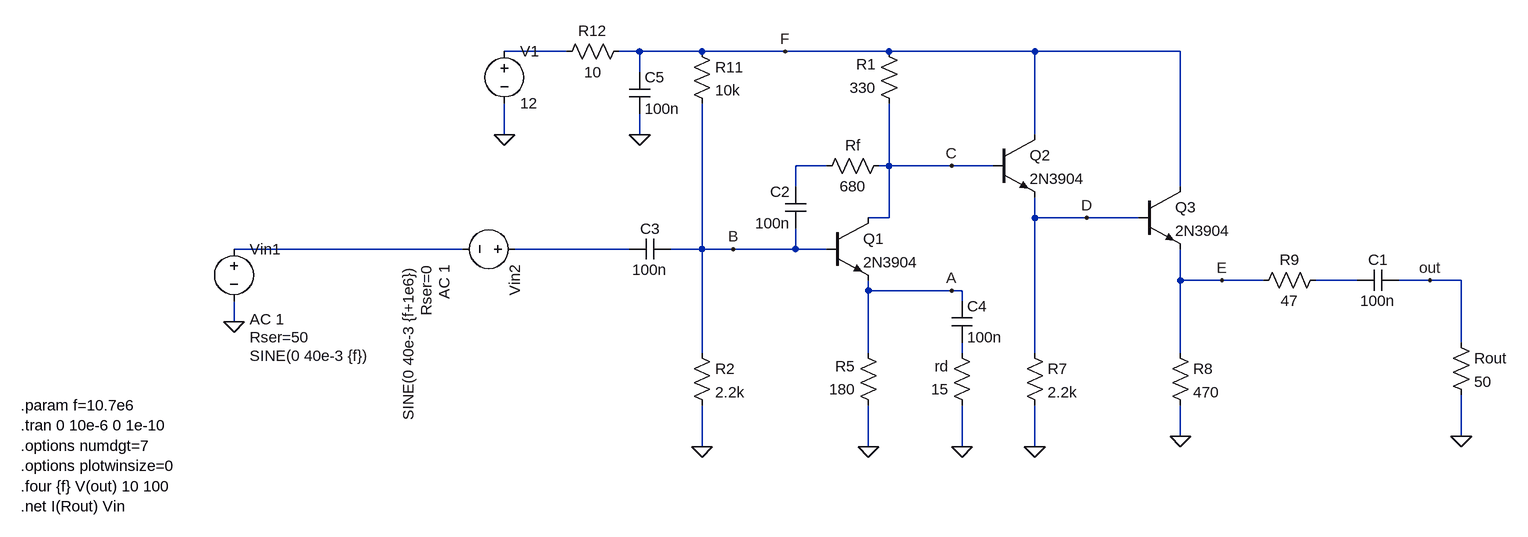
[diagram p0: schematic TIA3_12V_orig.asc]
TIA3_12V_orig.asc, the LTspice schematic file:
Version 4
SHEET 1 1168 680
WIRE -288 -128 -384 -128
WIRE -176 -128 -208 -128
WIRE -80 -128 -176 -128
WIRE 48 -128 -80 -128
WIRE 208 -128 48 -128
WIRE 432 -128 208 -128
WIRE 656 -128 432 -128
WIRE -176 -96 -176 -128
WIRE -384 0 -384 -48
WIRE -176 0 -176 -32
WIRE 432 0 432 -128
WIRE 112 48 64 48
WIRE 208 48 208 -48
WIRE 208 48 192 48
WIRE 304 48 208 48
WIRE 368 48 304 48
WIRE 64 80 64 48
WIRE 656 80 656 -128
WIRE 208 128 208 48
WIRE 208 128 176 128
WIRE 432 128 432 96
WIRE 512 128 432 128
WIRE 592 128 512 128
WIRE -448 176 -800 176
WIRE -192 176 -368 176
WIRE -80 176 -80 -48
WIRE -80 176 -128 176
WIRE -32 176 -80 176
WIRE 64 176 64 144
WIRE 64 176 -32 176
WIRE 112 176 64 176
WIRE 656 224 656 176
WIRE 720 224 656 224
WIRE 784 224 720 224
WIRE 928 224 864 224
WIRE 1040 224 992 224
WIRE 1088 224 1040 224
WIRE 176 240 176 224
WIRE 304 240 176 240
WIRE 320 240 304 240
WIRE 320 256 320 240
WIRE -800 288 -800 256
WIRE 1088 320 1088 224
WIRE -80 336 -80 176
WIRE 176 336 176 240
WIRE 320 336 320 320
WIRE 432 336 432 128
WIRE 656 336 656 224
WIRE 656 464 656 416
WIRE 1088 464 1088 400
WIRE -80 480 -80 416
WIRE 176 480 176 416
WIRE 320 480 320 416
WIRE 432 480 432 416
FLAG -80 480 0
FLAG 176 480 0
FLAG 320 480 0
FLAG 432 480 0
FLAG 656 464 0
FLAG 1088 464 0
FLAG -384 0 0
FLAG -176 0 0
FLAG 304 240 A
FLAG -32 176 B
FLAG 304 48 C
FLAG 512 128 D
FLAG 720 224 E
FLAG 48 -128 F
FLAG -800 288 0
FLAG 1040 224 out
SYMBOL npn 112 128 R0
SYMATTR InstName Q1
SYMATTR Value 2N3904
SYMBOL res -96 -144 R0
SYMATTR InstName R11
SYMATTR Value 10k
SYMBOL res -96 320 R0
SYMATTR InstName R2
SYMATTR Value 2.2k
SYMBOL res 208 32 R90
WINDOW 0 0 56 VBottom 2
WINDOW 3 32 56 VTop 2
SYMATTR InstName Rf
SYMATTR Value 680
SYMBOL res 224 -32 R180
WINDOW 0 36 76 Left 2
WINDOW 3 36 40 Left 2
SYMATTR InstName R1
SYMATTR Value 330
SYMBOL res 192 432 R180
WINDOW 0 36 76 Left 2
WINDOW 3 36 40 Left 2
SYMATTR InstName R5
SYMATTR Value 180
SYMBOL res 336 432 R180
WINDOW 0 36 76 Left 2
WINDOW 3 36 40 Left 2
SYMATTR InstName rd
SYMATTR Value 15
SYMBOL npn 368 0 R0
SYMATTR InstName Q2
SYMATTR Value 2N3904
SYMBOL npn 592 80 R0
SYMATTR InstName Q3
SYMATTR Value 2N3904
SYMBOL res 416 320 R0
SYMATTR InstName R7
SYMATTR Value 2.2k
SYMBOL res 640 320 R0
SYMATTR InstName R8
SYMATTR Value 470
SYMBOL res 880 208 R90
WINDOW 0 0 56 VBottom 2
WINDOW 3 32 56 VTop 2
SYMATTR InstName R9
SYMATTR Value 47
SYMBOL cap 992 208 R90
WINDOW 0 0 32 VBottom 2
WINDOW 3 32 32 VTop 2
SYMATTR InstName C1
SYMATTR Value 100n
SYMBOL cap 80 144 R180
WINDOW 0 24 56 Left 2
WINDOW 3 24 8 Left 2
SYMATTR InstName C2
SYMATTR Value 100n
SYMBOL cap -192 192 R270
WINDOW 0 32 32 VTop 2
WINDOW 3 0 32 VBottom 2
SYMATTR InstName C3
SYMATTR Value 100n
SYMBOL res 1072 304 R0
SYMATTR InstName Rout
SYMATTR Value 50
SYMBOL voltage -384 -144 R0
SYMATTR InstName V1
SYMATTR Value 12
SYMBOL cap 304 256 R0
SYMATTR InstName C4
SYMATTR Value 100n
SYMBOL res -192 -144 R90
WINDOW 0 0 56 VBottom 2
WINDOW 3 32 56 VTop 2
SYMATTR InstName R12
SYMATTR Value 10
SYMBOL cap -192 -96 R0
SYMATTR InstName C5
SYMATTR Value 100n
SYMBOL voltage -800 160 R0
WINDOW 3 24 180 Left 2
WINDOW 123 24 124 Left 2
WINDOW 39 24 152 Left 2
SYMATTR Value SINE(0 40e-3 {f})
SYMATTR Value2 AC 1
SYMATTR SpiceLine Rser=50
SYMATTR InstName Vin1
SYMBOL voltage -352 176 R90
WINDOW 3 24 180 Left 2
WINDOW 123 24 124 Left 2
WINDOW 39 24 152 Left 2
SYMATTR Value SINE(0 40e-3 {f+1e6})
SYMATTR Value2 AC 1
SYMATTR SpiceLine Rser=0
SYMATTR InstName Vin2
TEXT -1128 416 Left 2 !.param f=10.7e6\n.tran 0 10e-6 0 1e-10\n.options numdgt=7\n.options plotwinsize=0\n.four {f} V(out) 10 100\n.net I(Rout) Vin

The netlist it stands for:
* TIA3_12V_orig.asc
Q1 C B A 0 2N3904
R11 F B 10k
R2 B 0 2.2k
Rf C N002 680
R1 C F 330
R5 0 A 180
rd 0 N006 15
Q2 F C D 0 2N3904
Q3 F D E 0 2N3904
R7 D 0 2.2k
R8 E 0 470
R9 N005 E 47
C1 out N005 100n
C2 B N002 100n
C3 N004 B 100n
Rout out 0 50
V1 N001 0 12
C4 A N006 100n
R12 F N001 10
C5 F 0 100n
Vin1 N003 0 SINE(0 40e-3 {f}) AC 1 Rser=50
Vin2 N004 N003 SINE(0 40e-3 {f+1e6}) AC 1 Rser=0
.model NPN NPN
.model PNP PNP
.lib standard.bjt
.param f=10.7e6
.tran 0 10e-6 0 1e-10
.options numdgt=7
.options plotwinsize=0
.four {f} V(out) 10 100
.net I(Rout) Vin
.backanno
.end